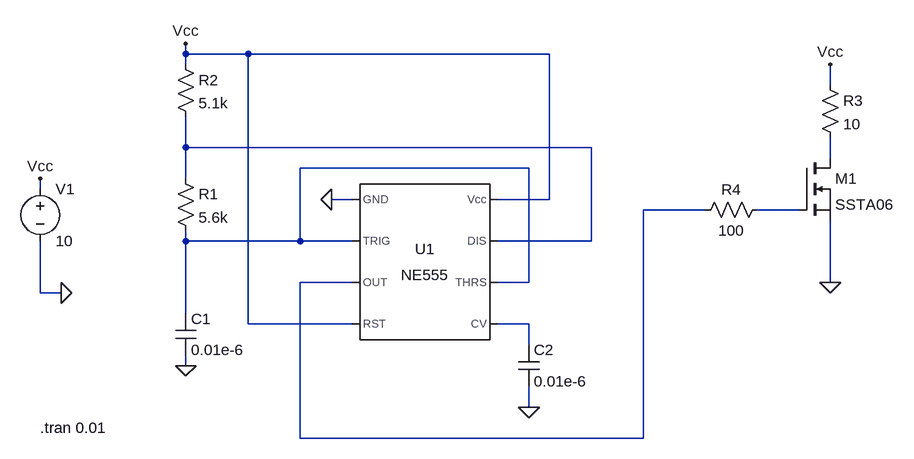
[diagram p0: schematic ШИМ на таймере.asc]
ШИМ на таймере.asc, the LTspice schematic file:
Version 4
SHEET 1 1524 680
WIRE 432 0 432 -16
WIRE 528 0 432 0
WIRE 992 0 528 0
WIRE 432 16 432 0
WIRE 1424 48 1424 16
WIRE 432 144 432 96
WIRE 1056 144 432 144
WIRE 1424 160 1424 128
WIRE 960 176 608 176
WIRE 432 192 432 144
WIRE 208 208 208 192
WIRE 688 224 656 224
WIRE 992 224 992 0
WIRE 992 224 912 224
WIRE 1232 240 1136 240
WIRE 1376 240 1312 240
WIRE 432 288 432 272
WIRE 608 288 608 176
WIRE 608 288 432 288
WIRE 688 288 608 288
WIRE 1056 288 1056 144
WIRE 1056 288 912 288
WIRE 688 352 608 352
WIRE 960 352 960 176
WIRE 960 352 912 352
WIRE 1424 352 1424 256
WIRE 208 368 208 288
WIRE 240 368 208 368
WIRE 432 400 432 288
WIRE 528 416 528 0
WIRE 688 416 528 416
WIRE 960 416 912 416
WIRE 960 448 960 416
WIRE 432 480 432 464
WIRE 960 544 960 512
WIRE 608 592 608 352
WIRE 1136 592 1136 240
WIRE 1136 592 608 592
FLAG 208 192 Vcc
FLAG 240 368 0
FLAG 432 480 0
FLAG 432 -16 Vcc
FLAG 960 544 0
FLAG 656 224 0
FLAG 1424 352 0
FLAG 1424 16 Vcc
SYMBOL voltage 208 192 R0
SYMATTR InstName V1
SYMATTR Value 10
SYMBOL cap 416 400 R0
SYMATTR InstName C1
SYMATTR Value 0.01e-6
SYMBOL res 416 0 R0
SYMATTR InstName R2
SYMATTR Value 5.1k
SYMBOL res 416 176 R0
SYMATTR InstName R1
SYMATTR Value 5.6k
SYMBOL Misc\\NE555 800 320 R0
SYMATTR InstName U1
SYMBOL cap 944 448 R0
SYMATTR InstName C2
SYMATTR Value 0.01e-6
SYMBOL res 1328 224 R90
WINDOW 0 0 56 VBottom 2
WINDOW 3 32 56 VTop 2
SYMATTR InstName R4
SYMATTR Value 100
SYMBOL res 1408 32 R0
SYMATTR InstName R3
SYMATTR Value 10
SYMBOL nmos 1376 160 R0
SYMATTR InstName M1
SYMATTR Value SSTA06
TEXT 208 576 Left 2 !.tran 0.01

The netlist it stands for:
* ШИМ на таймере.asc
V1 Vcc 0 10
C1 N003 0 0.01e-6
R2 Vcc N001 5.1k
R1 N001 N003 5.6k
XU1 0 N003 N004 Vcc N006 N003 N001 Vcc NE555  ; pins GND TRIG OUT RST CV THRS DIS Vcc
C2 N006 0 0.01e-6
R4 N005 N004 100
R3 Vcc N002 10
M1 N002 N005 0 0 SSTA06
.model NMOS NMOS
.model PMOS PMOS
.lib standard.mos
.tran 0.01
.lib NE555.sub
.backanno
.end